# Altium schematic sheet 8_DDR3L.SchDoc
size A; SheetNumber: 8; SheetTotal: 9
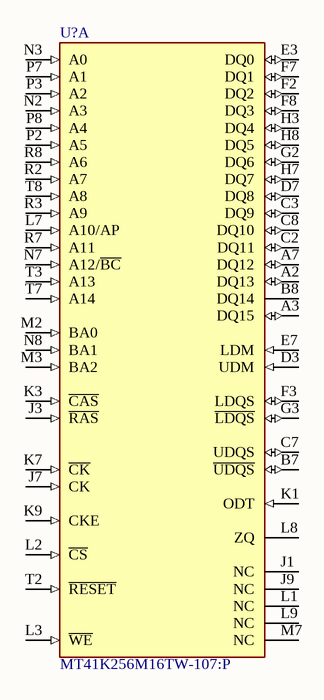
[diagram p0: 8_DDR3L.SchDoc]

## Parts
U?  MT41K256M16TW-107:P  [FP-TW-IPC_C]  (part A of 2)

## Nets

Not connected (* = marked no-connect by the designer): U? A2(DQ13) A3(DQ15) A7(DQ12) B7(~{UDQS}) B8(DQ14) C2(DQ11) C3(DQ9) C7(UDQS) C8(DQ10) D3(UDM) D7(DQ8) E3(DQ0) E7(LDM) F2(DQ2) F3(LDQS) F7(DQ1) F8(DQ3) G2(DQ6) G3(~{LDQS}) H3(DQ4) H7(DQ7) H8(DQ5) J1(NC) J3(~{RAS}) J7(CK) J9(NC) K1(ODT) K3(~{CAS}) K7(~{CK}) K9(CKE) L1(NC) L2(~{CS}) L3(~{WE}) L7(A10/AP) L8(ZQ) L9(NC) M2(BA0) M3(BA2) M7(NC) N2(A3) N3(A0) N7(A12/~{BC}) N8(BA1) P2(A5) P3(A2) P7(A1) P8(A4) R2(A7) R3(A9) R7(A11) R8(A6) T2(~{RESET}) T3(A13) T7(A14) T8(A8)

## Library data of the parts
U? = CMP-2000-07475-2: IC DRAM 4G PARALLEL 96FBGA; Manufacturer: Micron; Access Time: 1.07ns; Nominal Supply Current: 12-156mA; Description: DRAM Chip DDR3L SDRAM 4G-Bit 256Mx16 1.35V 96-Pin F-BGA; Min Supply Voltage: 1.283V; Memory Type: SDRAM,DDR3; Standoff Height: 0.29mm; Max Supply Voltage: 1.45V; Memory Size: 4Gbits; Device Class L1: Integrated Circuits (ICs); Lead Free: Yes; ComponentLink2Description: Datasheet; Manufacturer Part Number: MT41K256M16TW-107:P; Category: IC; Digikey Description: IC DRAM 4G PARALLEL 96FBGA; Device Class L3: RAM; Interface: Parallel; RoHS: TRUE; Octopart: https://octopart.com/mt41k256m16tw-107%3Ap-micron-66533852; Temperature Range High: +85°C; ComponentLink2URL: https://www.micron.com/-/media/client/global/documents/products/data-sheet/dram/ddr3/4gb_ddr3l.pdf; Temperature: 0°C to +85°C; Package: TW; Device Class L2: Memory; Automotive: No; Height: 1.2mm; Temperature Range Low: 0°C